# EAGLE board Sequencer-Memory-V1.0-3 (EAGLE 7.6.0)
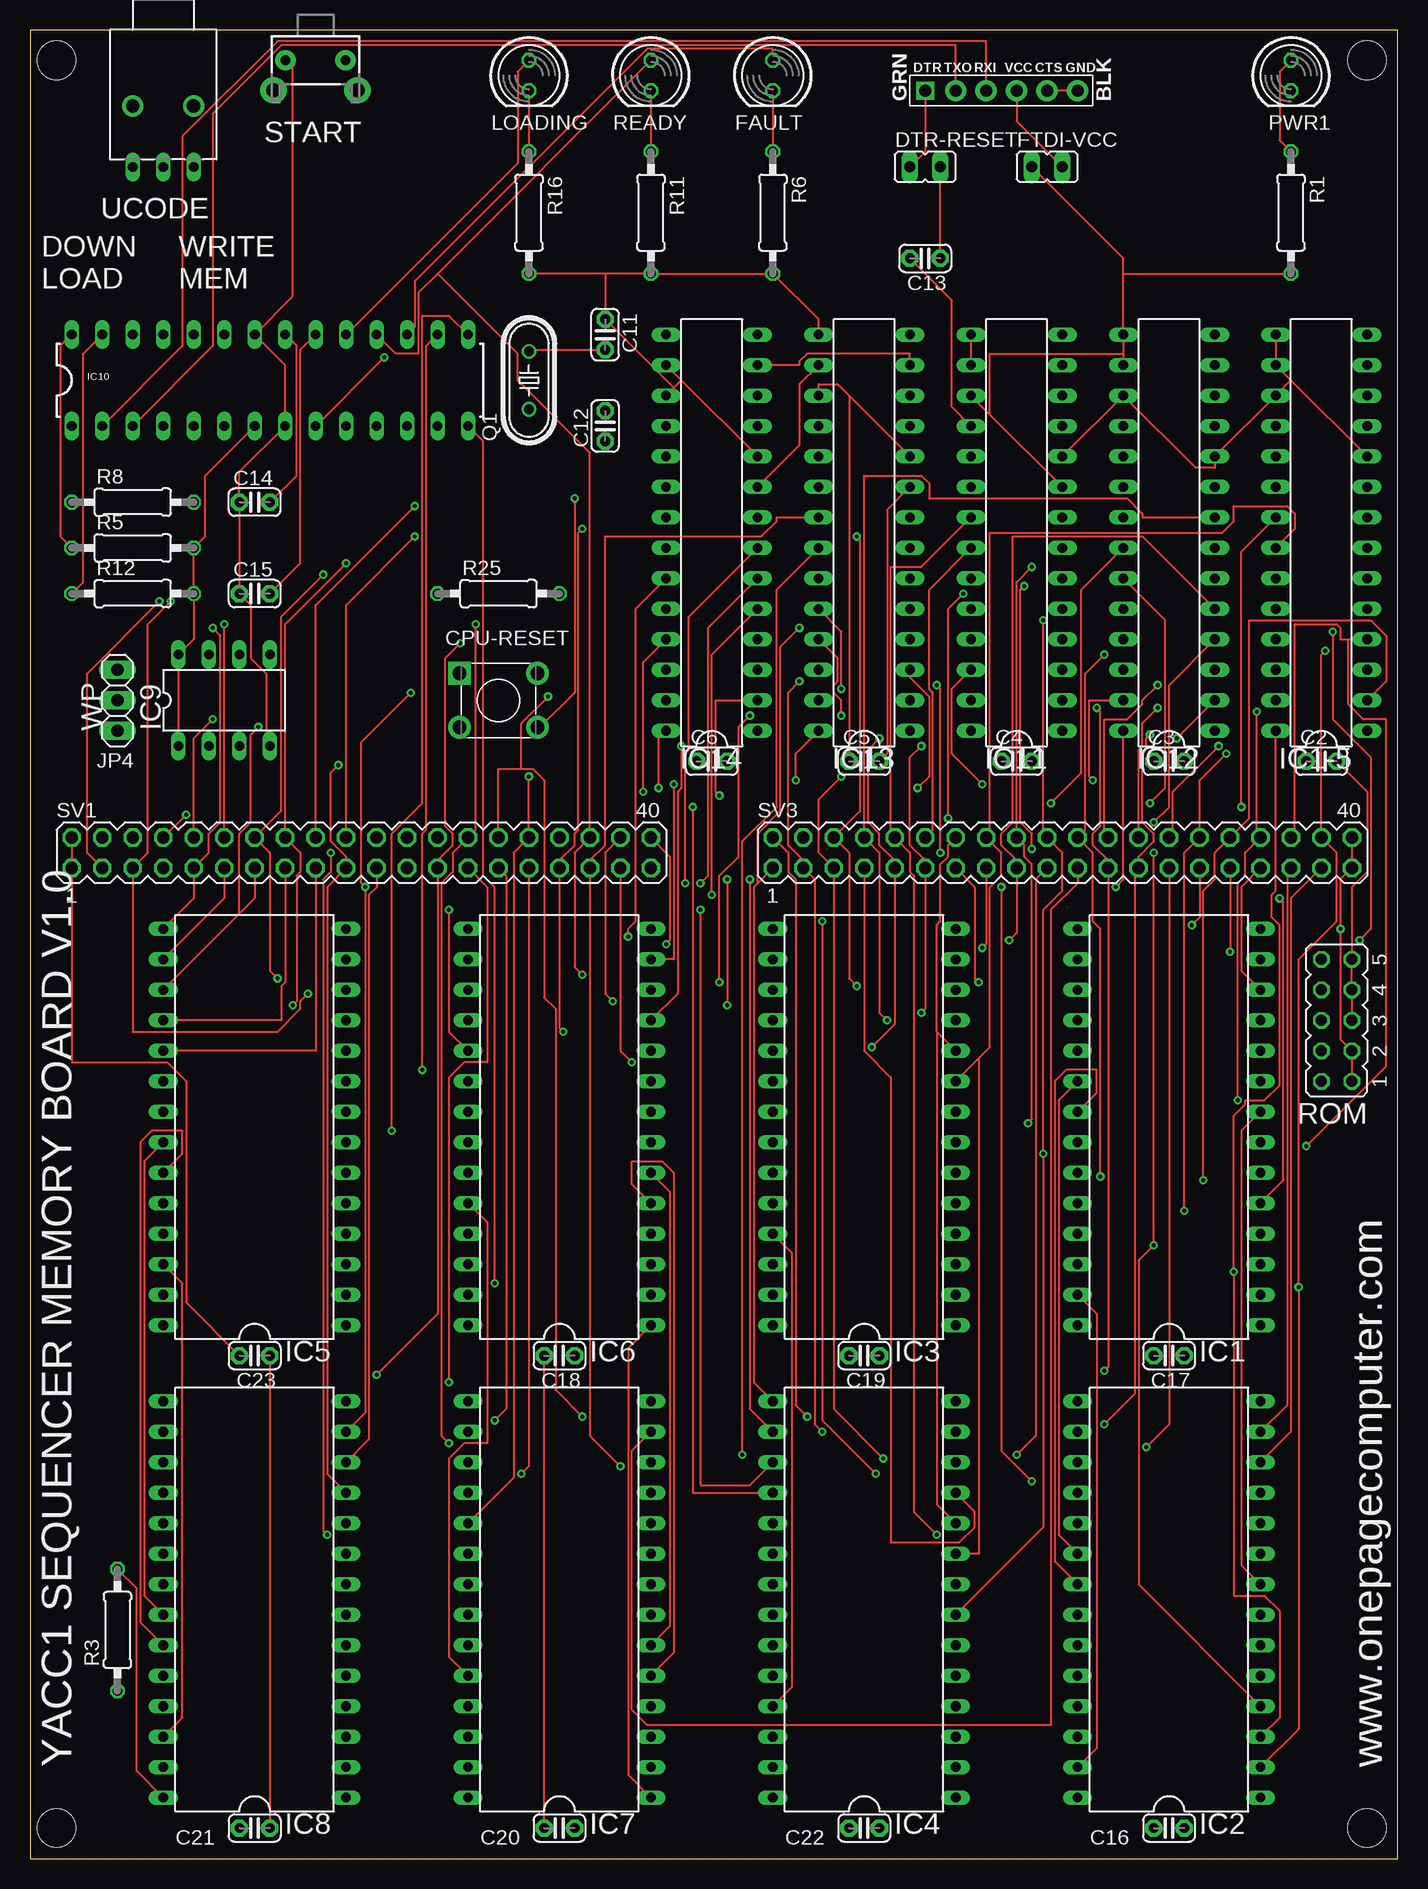
[diagram p4: board, top side]
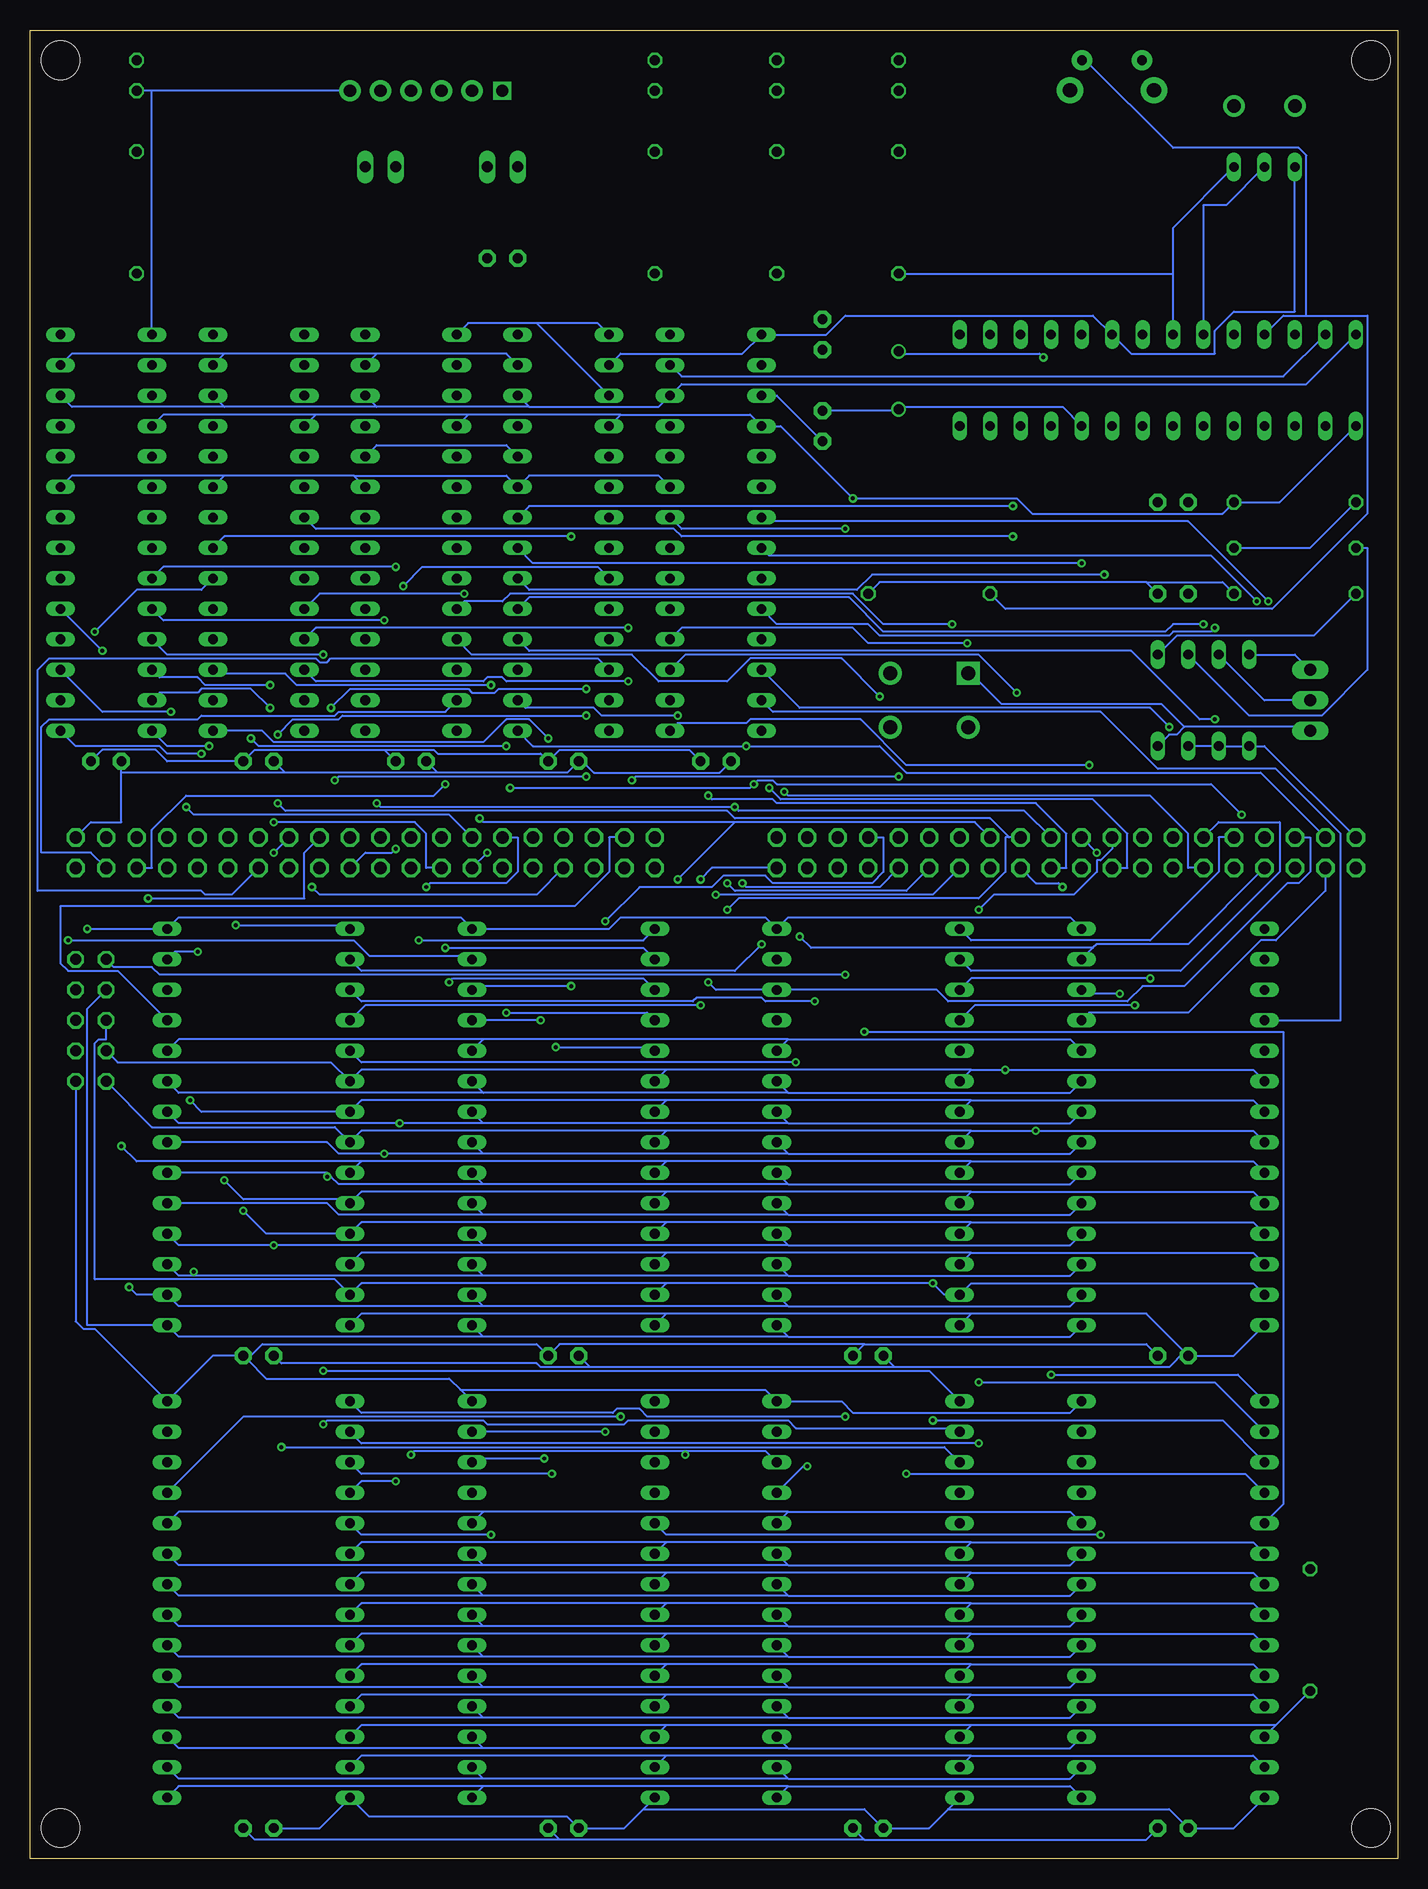
[diagram p5: board, bottom side, seen from below]

Size 113.97 x 152.38 mm. Coordinates in mm from the lower left corner, seen from the top.
Outline: 113.97,0 113.97,152.38 0,152.38 0,0 113.97,0
Copper layers (1*16): Top 0.0356mm / dielectric 1.5011mm / Bottom 0.0356mm
Design rules "LaenPCBOrder *": minimum track width 6mil, minimum drill 13mil, track to track 6mil, track to pad 6mil, pad to pad 6mil, via to via 6mil, smd to smd 6mil, copper to edge 15mil, drill to drill 6mil, minimum pad ring 7mil, minimum via ring 7mil, stop-mask expansion 3mil, vias tented up to drill 0mil, thermal gap 10mil
Holes 3.2 mm at 111.43,2.54 111.43,149.86 2.21,149.86 2.21,2.54

## Footprints (pad centres in the part's own frame; a part is rotated, then mirrored left to right if it is on the bottom)
C025-024X044 = drill 0.813 pad 1.422 octagon: 1 -1.27,0; 2 1.27,0
SW4-6.2X6.2X5.0MM = drill 1.143 pad 1.905 square: 1 -3.25,2.25 | drill 1.143 pad 1.905: 2 -3.25,-2.25; 3 3.25,-2.25; 4 3.25,2.25
JP1 = drill 0.914 long: 1 0,-1.27; 2 0,1.27
LED5MM = drill 0.813 octagon: A -1.27,0; K 1.27,0
DIL28-6 = drill 0.813 long: 1 -16.51,-7.62; 2 -13.97,-7.62; 3 -11.43,-7.62; 4 -8.89,-7.62; 5 -6.35,-7.62; 6 -3.81,-7.62; 7 -1.27,-7.62; 8 1.27,-7.62; 9 3.81,-7.62; 10 6.35,-7.62; 11 8.89,-7.62; 12 11.43,-7.62; 13 13.97,-7.62; 14 16.51,-7.62; 15 16.51,7.62; 16 13.97,7.62; 17 11.43,7.62; 18 8.89,7.62; 19 6.35,7.62; 20 3.81,7.62; 21 1.27,7.62; 22 -1.27,7.62; 23 -3.81,7.62; 24 -6.35,7.62; 25 -8.89,7.62; 26 -11.43,7.62; 27 -13.97,7.62; 28 -16.51,7.62
DIL28-3 = drill 0.813 long: 1 -16.51,-3.81; 2 -13.97,-3.81; 3 -11.43,-3.81; 4 -8.89,-3.81; 5 -6.35,-3.81; 6 -3.81,-3.81; 7 -1.27,-3.81; 8 1.27,-3.81; 9 3.81,-3.81; 10 6.35,-3.81; 11 8.89,-3.81; 12 11.43,-3.81; 13 13.97,-3.81; 14 16.51,-3.81; 15 16.51,3.81; 16 13.97,3.81; 17 11.43,3.81; 18 8.89,3.81; 19 6.35,3.81; 20 3.81,3.81; 21 1.27,3.81; 22 -1.27,3.81; 23 -3.81,3.81; 24 -6.35,3.81; 25 -8.89,3.81; 26 -11.43,3.81; 27 -13.97,3.81; 28 -16.51,3.81
DIL8 = drill 0.813 long: 1 -3.81,-3.81; 2 -1.27,-3.81; 3 1.27,-3.81; 4 3.81,-3.81; 5 3.81,3.81; 6 1.27,3.81; 7 -1.27,3.81; 8 -3.81,3.81
FTDI_DEVICE_SIDE = drill 1 square: P$1 -6.35,0 | drill 1.016 pad 1.778: P$2 -3.81,0; P$3 -1.27,0; P$4 1.27,0; P$5 3.81,0; P$6 6.35,0
1X03 = drill 1.016 long: 1 -2.54,0; 2 0,0; 3 2.54,0
HC49/S = drill 0.813: 1 -2.413,0; 2 2.413,0
0207/10 = drill 0.813 octagon: 1 -5.08,0; 2 5.08,0
JP5Q = drill 0.914 octagon: 1 -5.08,-1.27; 2 -5.08,1.27; 3 -2.54,-1.27; 4 -2.54,1.27; 5 0,-1.27; 6 0,1.27; 7 2.54,-1.27; 8 2.54,1.27; 9 5.08,-1.27; 10 5.08,1.27
TACTILE-PTH-SIDEEZ = drill 0.8 pad 1.7: 1 -2.5,0; 2 2.5,0 | drill 1.2 pad 2.2: ANCHOR1 -3.5,2.5; ANCHOR2 3.5,2.5
MA20-2 = drill 1.016 octagon: 1 -24.13,-1.27; 2 -24.13,1.27; 3 -21.59,-1.27; 4 -21.59,1.27; 5 -19.05,-1.27; 6 -19.05,1.27; 7 -16.51,-1.27; 8 -16.51,1.27; 9 -13.97,-1.27; 10 -13.97,1.27; 11 -11.43,-1.27; 12 -11.43,1.27; 13 -8.89,-1.27; 14 -8.89,1.27; 15 -6.35,-1.27; 16 -6.35,1.27; 17 -3.81,-1.27; 18 -3.81,1.27; 19 -1.27,-1.27; 20 -1.27,1.27; 21 1.27,-1.27; 22 1.27,1.27; 23 3.81,-1.27; 24 3.81,1.27; 25 6.35,-1.27; 26 6.35,1.27; 27 8.89,-1.27; 28 8.89,1.27; 29 11.43,-1.27; 30 11.43,1.27; 31 13.97,-1.27; 32 13.97,1.27; 33 16.51,-1.27; 34 16.51,1.27; 35 19.05,-1.27; 36 19.05,1.27; 37 21.59,-1.27; 38 21.59,1.27; 39 24.13,-1.27; 40 24.13,1.27
9070-1W = drill 0.813 long: 1 5.08,-2.54; 2 5.08,0; 3 5.08,2.54 | drill 1.118 pad 1.778: B 0,-2.54; B1 0,2.54

## Placement (x,y rotation side)
C2  0.1  [C025-024X044]  107.62,91.44 0 top
C3  0.1  [C025-024X044]  94.92,91.44 0 top
C4  0.1  [C025-024X044]  82.22,91.44 0 top
C5  0.1  [C025-024X044]  69.52,91.44 0 top
C6  0.1  [C025-024X044]  56.82,91.44 0 top
C11  20pf  [C025-024X044]  47.93,127 270 top
C12  20pf  [C025-024X044]  47.93,119.38 90 top
C13  0.1  [C025-024X044]  74.6,133.35 180 top
C14  0.1  [C025-024X044]  18.72,113.03 0 top
C15  0.1  [C025-024X044]  18.72,105.41 0 top
C16  0.1  [C025-024X044]  94.92,2.54 180 top
C17  0.1  [C025-024X044]  94.92,41.91 180 top
C18  0.1  [C025-024X044]  44.12,41.91 180 top
C19  0.1  [C025-024X044]  69.52,41.91 180 top
C20  0.1  [C025-024X044]  44.12,2.54 180 top
C21  0.1  [C025-024X044]  18.72,2.54 180 top
C22  0.1  [C025-024X044]  69.52,2.54 180 top
C23  0.1  [C025-024X044]  18.72,41.91 180 top
CPU-RESET  TS-1109-7  [SW4-6.2X6.2X5.0MM]  39.04,96.52 0 top
DTR-RESET  [JP1]  74.6,140.97 270 top
FAULT  [LED5MM]  61.9,148.59 270 top
FTDI-VCC  [JP1]  84.76,140.97 270 top
IC1  [DIL28-6]  94.92,60.96 90 top
IC1-5  MCP23017SP  [DIL28-3]  107.62,110.49 90 top
IC2  [DIL28-6]  94.92,21.59 90 top
IC3  [DIL28-6]  69.52,60.96 90 top
IC4  [DIL28-6]  69.52,21.59 90 top
IC5  [DIL28-6]  18.72,60.96 90 top
IC6  [DIL28-6]  44.12,60.96 90 top
IC7  [DIL28-6]  44.12,21.59 90 top
IC8  [DIL28-6]  18.72,21.59 90 top
IC9  24AA01P  [DIL8]  16.18,96.52 0 top
IC10  ATMEGA328P_PDIP  [DIL28-3]  19.99,123.19 0 top
IC11  MCP23017SP  [DIL28-3]  82.22,110.49 90 top
IC12  MCP23017SP  [DIL28-3]  94.92,110.49 90 top
IC13  MCP23017SP  [DIL28-3]  69.52,110.49 90 top
IC14  MCP23017SP  [DIL28-3]  56.82,110.49 90 top
JP3  FTDI_DEVICE  [FTDI_DEVICE_SIDE]  80.95,147.32 0 top
JP4  [1X03]  7.29,96.52 90 top
LOADING  [LED5MM]  41.58,148.59 270 top
PWR1  [LED5MM]  105.08,148.59 270 top
Q1  16Mhz  [HC49/S]  41.58,123.19 90 top
R1  330  [0207/10]  105.08,137.16 270 top
R3  10k  [0207/10]  7.29,19.05 90 top
R5  2.2k  [0207/10]  8.56,109.22 0 top
R6  330  [0207/10]  61.9,137.16 270 top
R8  10k  [0207/10]  8.56,113.03 0 top
R11  330  [0207/10]  51.74,137.16 270 top
R12  2.2k  [0207/10]  8.56,105.41 0 top
R16  330  [0207/10]  41.58,137.16 270 top
R25  10k  [0207/10]  39.04,105.41 0 top
READY  [LED5MM]  51.74,148.59 270 top
ROM  [JP5Q]  108.89,69.85 90 top
START  SWITCH-MOMENTARY-2SIDE_EZ  [TACTILE-PTH-SIDEEZ]  23.8,149.86 180 top
SV1  [MA20-2]  27.61,83.82 0 top
SV3  [MA20-2]  86.03,83.82 0 top
UCODE  [9070-1W]  11.1,146.05 270 top

## Tracks (layer width: path | path; a pad name or v marks a point on that pad's centre or on a via)
1-BYTE-OPERAND-SEL  (via drill 0.33)
  Top 0.152: SV3.31 v100,75.56
  Bottom 0.152: IC1.13 101.91,75.56 v100,75.56
2-BYTE-OPERAND-SEL  (via drill 0.33)
  Top 0.152: v96.83,77.79 97.46,78.42 SV3.29
  Bottom 0.152: IC1.15 87.62,77.79 v96.83,77.79
-CMEMRD  (via drill 0.33)
  Top 0.152: IC10.15 34.91,128.59 32.69,128.59 32.69,87.95 30.15,85.41 v30.15,60.64 | IC8.22 9.51,21.91 9.51,58.1 IC5.22
  Bottom 0.152: IC8.22 12.05,21.27 35.55,21.27 | IC7.22 35.55,21.27 | 60.95,21.27 IC4.22 | 35.55,21.27 60.95,21.27 | IC2.22 86.35,21.27 60.95,21.27 | ROM.2 103.81,60.96 88.57,60.96 IC1.22 86.35,60.64 60.95,60.64 | IC5.22 12.05,60.64 v30.15,60.64 35.55,60.64 | IC6.22 35.55,60.64 | 60.95,60.64 IC3.22 | 35.55,60.64 60.95,60.64
-CMEMSEL  (via drill 0.33)
  Top 0.152: IC10.16 33.01,126.05 33.01,85.72 32.69,85.41 v32.69,65.72 | IC2.20 85.71,26.99 85.71,63.18 IC1.20
  Bottom 0.152: IC8.20 12.05,26.35 35.55,26.35 | IC7.20 35.55,26.35 | 60.95,26.35 IC4.20 | 35.55,26.35 60.95,26.35 | IC2.20 86.35,26.35 60.95,26.35 | ROM.4 106.67,66.36 88.89,66.36 IC1.20 86.35,65.72 60.95,65.72 | IC5.20 12.05,65.72 v32.69,65.72 35.55,65.72 | IC6.20 35.55,65.72 | 60.95,65.72 IC3.20 | 35.55,65.72 60.95,65.72
-CMEMWR  (via drill 0.33)
  Top 0.152: IC10.14 37.77,118.11 37.77,81.92 38.72,80.96 v38.72,47.94 | IC2.27 88.89,9.21 88.89,45.4 IC1.27
  Bottom 0.152: IC8.27 12.05,8.57 35.55,8.57 | IC7.27 35.55,8.57 | 60.95,8.57 IC4.27 | 35.55,8.57 60.95,8.57 | IC2.27 86.35,8.57 60.95,8.57 | IC5.27 12.05,47.94 35.55,47.94 IC6.27 37.77,46.99 v38.72,47.94 60.95,47.94 | 60.95,47.94 IC3.27 | 60.95,47.94 86.35,47.94 IC1.27 88.57,48.26 108.57,48.26 108.57,67.94 108.25,68.26 107.62,68.26 ROM.6
-RESET  (via drill 0.33)
  Top 0.152: C13.2 76.82,129.86 76.82,120.97 IC11.18 | v45.39,113.35 45.39,97.16 42.53,94.3 CPU-RESET.3
  Bottom 0.152: IC10.1 9.83,113.03 R8.2 14.59,112.08 30.47,112.08 31.74,113.35 v45.39,113.35 51.42,119.38 IC14.18 53.96,120.33 64.76,120.33 | IC13.18 64.76,120.33 | 77.46,120.33 IC11.18 | 64.76,120.33 77.46,120.33 | 90.16,120.33 IC12.18 | 77.46,120.33 90.16,120.33 | IC1-5.18 102.86,120.33 90.16,120.33
AC-LD  (via drill 0.33)
  Top 0.152: v79.05,73.03 78.73,73.34 78.73,80.96 SV3.13 | v75.55,97.79 75.87,97.47 v75.87,83.82
  Bottom 0.152: IC3.17 62.85,73.34 78.73,73.34 v79.05,73.03 | IC12.3 98.41,98.74 92.7,98.74 91.75,97.79 v75.55,97.79 | SV3.13 v75.87,83.82
AC-LD-INV  (via drill 0.33)
  Top 0.152: v74.28,70.48 74.6,70.8 SV3.11 74.6,83.19 73.33,84.45 73.33,91.76 v74.28,92.71 | v95.56,93.34 IC12.2
  Bottom 0.152: IC3.18 62.54,70.48 v74.28,70.48 | v95.56,93.34 94.92,92.71 v74.28,92.71
AC-RD  (via drill 0.33)
  Top 0.152: v79.36,75.88 79.68,76.2 SV3.15 | IC12.4 94.92,97.79 94.92,87.63 v93.65,86.36
  Bottom 0.152: IC3.16 62.85,75.88 v79.36,75.88 | v93.65,86.36 81.9,86.36 80.95,85.41 80.95,82.55 SV3.15
ADDR-REG-ID0  (via drill 0.33)
  Top 0.152: v23.17,72.07 22.53,71.44 22.53,70.8 20.62,68.9 8.56,68.9 SV1.5 9.83,83.82 9.83,102.87 v11.73,104.78
  Bottom 0.152: IC5.12 26.02,72.07 v23.17,72.07 | IC14.22 52.38,108.58 15.54,108.58 v11.73,104.78
ADDR-REG-ID1  (via drill 0.33)
  Top 0.152: IC14.23 50.47,104.14 50.47,78.11 49.84,77.47 v49.84,76.83
  Bottom 0.152: 25.39,75.88 25.07,76.2 17.45,76.2 SV1.7 | 25.39,75.88 IC5.13 | v49.84,76.83 48.88,75.88 25.39,75.88
ADDR-REG-LD  (via drill 0.33)
  Top 0.152: IC5.15 13.64,80.01 SV1.9 14.91,83.82 14.91,85.41 15.86,86.36 15.86,101.92 v15.23,102.55
  Bottom 0.152: IC14.24 51.74,102.87 44.12,102.87 43.17,101.92 19.04,101.92 18.72,102.23 15.54,102.23 v15.23,102.55
ADDR-REG-RD  (via drill 0.33)
  Top 0.152: IC5.16 16.18,80.01 SV1.11 | IC14.25 51.11,99.69 v51.11,88.9
  Bottom 0.152: v51.11,88.9 50.79,88.58 20.62,88.58 17.45,85.41 17.45,82.55 SV1.11
ALU0  (via drill 0.33)
  Top 0.152: v66.03,35.56 65.39,36.2 65.39,81.6 SV3.3 64.44,83.19 63.17,84.45 63.17,97.16 v64.12,98.11
  Bottom 0.152: v66.03,35.56 IC4.13 | IC12.26 90.16,98.11 76.19,98.11 75.87,98.42 74.6,98.42 74.28,98.11 v64.12,98.11
ALU1  (via drill 0.33)
  Top 0.152: v71.11,33.34 66.98,37.47 SV3.5 65.71,83.82 65.71,88.27 v67.61,90.17 | IC12.27 88.25,96.52 88.25,90.17 v88.57,89.85
  Bottom 0.152: IC4.12 76.82,33.34 v71.11,33.34 | v88.57,89.85 88.25,90.17 v67.61,90.17
ALU2  (via drill 0.33)
  Top 0.152: IC4.11 78.73,28.89 78.73,27.62 77.46,26.35 71.74,26.35 71.74,65.09 69.52,67.31 SV3.7 | IC12.28 91.11,81.6 v90.48,80.96
  Bottom 0.152: v90.48,80.96 89.84,80.33 71.74,80.33 SV3.7
ALU3  (via drill 0.33)
  Top 0.152: v70.16,67.63 72.06,69.53 SV3.9 72.06,83.19 70.79,84.45 70.79,85.41 69.84,86.36 69.84,92.39 v70.79,93.34
  Bottom 0.152: IC3.19 62.22,67.63 v70.16,67.63 | IC12.1 94.6,93.98 93.65,93.03 76.19,93.03 74.28,94.93 72.38,94.93 v70.79,93.34
ALU-FUNC  (via drill 0.33)
  Top 0.152: IC4.15 60.31,39.69 60.31,80.96 60.63,81.28 | SV3.1 60.63,81.28 | v64.12,102.55 62.54,100.97 62.54,87.31 60.63,85.41 60.63,81.28
  Bottom 0.152: IC12.25 90.16,102.55 v64.12,102.55
ARD-RXIN
  Top 0.152: IC10.2 12.69,126.05 12.69,143.51 20.62,151.45 79.68,151.45 JP3.P$3
ARD-TXOUT
  Top 0.152: IC10.3 15.23,126.05 15.23,145.41 20.94,151.13 77.14,151.13 JP3.P$2
BR-COND  (via drill 0.33)
  Top 0.152: v110.8,76.52 111.75,77.47 111.75,91.76 108.57,94.93 v108.57,102.23
  Bottom 0.152: IC3.13 77.46,75.25 85.71,75.25 86.98,76.52 v110.8,76.52 | v108.57,102.23 105.08,105.73 99.68,105.73 IC12.6
BRANCH-LD-HI  (via drill 0.33)
  Top 0.152: v53.01,76.2 53.33,76.52 53.33,83.5 SV1.40
  Bottom 0.152: IC1.16 86.35,73.98 55.23,73.98 v53.01,76.2
BRANCH-LD-LO  (via drill 0.33)
  Top 0.152: v58.09,81.6 v58.09,71.12
  Bottom 0.152: IC1.18 86.03,71.12 v58.09,71.12 | v58.09,81.6 57.14,82.55 SV1.39
BRANCH-RD-HI  (via drill 0.33)
  Top 0.152: v48.57,71.44 47.93,72.07 47.93,83.82 SV1.38
  Bottom 0.152: IC1.17 86.35,71.44 58.73,71.44 58.41,71.75 53.01,71.75 52.69,71.44 v48.57,71.44
BRANCH-RD-LO  (via drill 0.33)
  Top 0.152: v50.15,66.36 49.2,67.31 SV1.37
  Bottom 0.152: IC1.19 86.35,66.36 v50.15,66.36
CADDR0  (via drill 0.33)
  Top 0.152: IC1-5.21 100.95,108.9 v100.95,87.63 | SV3.14 76.5,84.45 76.5,83.5 75.87,82.87 75.87,78.11 75.55,77.79 75.55,68.9 | IC3.10 75.55,68.9 | IC4.10 75.55,29.53 75.55,68.9
  Bottom 0.152: IC8.10 27.29,28.89 50.79,28.89 | IC7.10 50.79,28.89 | 76.19,28.89 IC4.10 | 50.79,28.89 76.19,28.89 | IC2.10 101.59,28.89 76.19,28.89 | v100.95,87.63 100.32,87 79.05,87 SV3.14 | IC5.10 27.29,68.26 50.79,68.26 | IC6.10 50.79,68.26 | 76.19,68.26 IC3.10 | 50.79,68.26 76.19,68.26 | IC1.10 101.59,68.26 76.19,68.26
CADDR1
  Top 0.152: IC1-5.22 105.4,110.81 105.4,112.08 104.76,112.71 100.32,112.71 100.32,111.44 99.36,110.49 80,110.49 80,85.41 SV3.16 80.95,83.82 80.95,81.92 80,80.96 80,67.63 79.05,66.67 | IC3.9 79.05,66.67 | IC4.9 79.05,25.4 79.05,66.67
  Bottom 0.152: IC8.9 27.29,24.45 50.79,24.45 | IC7.9 50.79,24.45 | 76.19,24.45 IC4.9 | 50.79,24.45 76.19,24.45 | IC2.9 101.59,24.45 76.19,24.45 | IC5.9 27.29,63.82 50.79,63.82 | IC6.9 50.79,63.82 | 76.19,63.82 IC3.9 | 50.79,63.82 76.19,63.82 | IC1.9 101.59,63.82 76.19,63.82
CADDR2  (via drill 0.33)
  Top 0.152: v83.49,107.63 82.22,106.36 SV3.18 82.86,84.45 82.86,83.5 83.49,82.87 83.49,61.59 v83.17,61.28 | IC2.8 100.95,24.45 100.95,60.64 IC1.8
  Bottom 0.152: IC8.8 27.29,21.91 50.79,21.91 | IC7.8 50.79,21.91 | 76.19,21.91 IC4.8 | 50.79,21.91 76.19,21.91 | IC2.8 101.59,21.91 76.19,21.91 | IC1-5.23 102.86,107.63 v83.49,107.63 | IC5.8 27.29,61.28 50.79,61.28 | IC6.8 50.79,61.28 | 76.19,61.28 IC3.8 | 50.79,61.28 76.19,61.28 | IC1.8 101.59,61.28 v83.17,61.28 76.19,61.28
CADDR3  (via drill 0.33)
  Top 0.152: v84.44,103.19 84.44,85.41 SV3.20 86.03,83.82 86.03,80.64 84.44,79.06 v84.44,58.74 84.44,27.62 IC4.7
  Bottom 0.152: IC8.7 27.29,19.37 50.79,19.37 | IC7.7 50.79,19.37 | 76.19,19.37 IC4.7 | 50.79,19.37 76.19,19.37 | IC2.7 101.59,19.37 76.19,19.37 | IC1-5.24 102.86,103.19 v84.44,103.19 | IC5.7 27.29,58.74 50.79,58.74 | IC6.7 50.79,58.74 | 76.19,58.74 IC3.7 | 50.79,58.74 76.19,58.74 | IC1.7 89.2,59.69 88.25,58.74 v84.44,58.74 76.19,58.74
CADDR4  (via drill 0.33)
  Top 0.152: v89.52,100.33 87.94,98.74 87.94,85.72 SV3.22 88.57,83.82 88.57,78.11 89.2,77.47 v89.2,56.83 | IC7.6 53.33,19.37 53.33,55.56 IC6.6
  Bottom 0.152: IC8.6 27.29,16.83 50.79,16.83 | IC7.6 50.79,16.83 | 76.19,16.83 IC4.6 | 50.79,16.83 76.19,16.83 | IC2.6 101.59,16.83 76.19,16.83 | IC1-5.25 102.54,100.33 v89.52,100.33 | IC5.6 27.29,56.2 50.79,56.2 | IC6.6 50.79,56.2 | 76.19,56.2 IC3.6 | 50.79,56.2 76.19,56.2 | IC1.6 89.2,57.15 88.89,56.83 | 88.89,56.83 88.25,56.2 76.19,56.2 | 88.89,56.83 v89.2,56.83
CADDR5  (via drill 0.33)
  Top 0.152: v93.97,97.79 92.7,96.52 92.7,96.2 91.43,94.93 89.52,94.93 89.52,85.41 SV3.24 | v104.13,80.01 104.45,79.69 104.45,56.52 IC1.5 | IC7.5 53.65,17.14 53.65,57.15 52.69,58.1 50.15,58.1 50.15,56.2 IC6.5
  Bottom 0.152: IC8.5 27.29,14.29 50.79,14.29 | IC7.5 50.79,14.29 | 76.19,14.29 IC4.5 | 50.79,14.29 76.19,14.29 | IC2.5 101.59,14.29 76.19,14.29 | IC1-5.26 103.17,98.42 100,98.42 99.36,97.79 v93.97,97.79 | IC5.5 27.29,53.66 50.79,53.66 | IC6.5 50.79,53.66 | 76.19,53.66 IC3.5 | 50.79,53.66 76.19,53.66 | IC1.5 89.2,54.61 88.25,53.66 76.19,53.66 | SV3.24 91.11,83.82 91.11,80.01 v104.13,80.01
CADDR6  (via drill 0.33)
  Top 0.152: v93.97,95.89 92.7,94.61 92.7,92.71 92.38,92.39 SV3.26 | v93.65,83.82 v93.65,51.12 92.38,49.85 92.38,22.86 IC2.4
  Bottom 0.152: IC8.4 27.29,11.75 50.79,11.75 | IC7.4 50.79,11.75 | 76.19,11.75 IC4.4 | 50.79,11.75 76.19,11.75 | IC2.4 101.59,11.75 76.19,11.75 | IC1-5.27 103.17,97.16 100,97.16 99.68,97.47 95.56,97.47 v93.97,95.89 | IC5.4 27.29,51.12 50.79,51.12 | IC6.4 50.79,51.12 | 76.19,51.12 IC3.4 | 50.79,51.12 76.19,51.12 | IC1.4 101.59,51.12 v93.65,51.12 76.19,51.12 | v93.65,83.82 SV3.26
CADDR7  (via drill 0.33)
  Top 0.152: v99.05,92.71 95.24,88.9 95.24,85.41 SV3.28 | IC1-5.28 103.81,80.64 103.49,80.33 103.49,78.42 104.13,77.79 104.13,64.45 102.86,63.18 101.27,63.18 101.27,62.87 100.32,61.91 v100.32,48.9 100.32,21.91 102.86,21.91 104.13,20.64 104.13,11.75 IC2.3
  Bottom 0.152: IC8.3 27.29,9.21 50.79,9.21 | IC7.3 50.79,9.21 | 76.19,9.21 IC4.3 | 50.79,9.21 76.19,9.21 | IC2.3 101.59,9.21 76.19,9.21 | IC1-5.28 102.54,92.71 v99.05,92.71 | IC5.3 27.29,48.58 50.79,48.58 | IC6.3 50.79,48.58 | 76.19,48.58 IC3.3 | 50.79,48.58 76.19,48.58 | IC1.3 101.59,48.58 100.32,48.58 | 76.19,48.58 100.32,48.58 | 100.32,48.58 v100.32,48.9
CADDR8  (via drill 0.33)
  Top 0.152: v99.68,92.08 97.46,89.85 SV3.30 96.19,83.82 v96.19,53.98 | IC4.25 63.49,14.29 63.49,50.48 IC3.25
  Bottom 0.152: IC8.25 12.05,13.65 35.55,13.65 | IC7.25 35.55,13.65 | 60.95,13.65 IC4.25 | 35.55,13.65 60.95,13.65 | IC2.25 86.35,13.65 60.95,13.65 | IC1-5.1 110.16,92.71 103.17,92.71 102.54,92.08 v99.68,92.08 | IC5.25 12.05,53.02 35.55,53.02 | IC6.25 35.55,53.02 | 60.95,53.02 IC3.25 | 35.55,53.02 60.95,53.02 | 60.95,53.02 86.35,53.02 IC1.25 94.28,52.07 v96.19,53.98
CADDR9  (via drill 0.33)
  Top 0.152: IC1-5.2 113.02,98.11 113.02,101.92 111.75,103.19 101.59,103.19 101.59,86.68 SV3.32 98.73,83.82 98.73,81.6 97.78,80.64 v97.78,56.52 | IC7.24 34.91,16.83 34.91,33.34 36.18,34.61 38.09,34.61 38.09,53.02 IC6.24
  Bottom 0.152: IC8.24 12.05,16.19 35.55,16.19 | IC7.24 35.55,16.19 | 60.95,16.19 IC4.24 | 35.55,16.19 60.95,16.19 | IC2.24 86.35,16.19 60.95,16.19 | IC5.24 12.05,55.56 35.55,55.56 | IC6.24 35.55,55.56 | 60.95,55.56 IC3.24 | 35.55,55.56 60.95,55.56 | 86.98,54.93 86.35,55.56 60.95,55.56 | v97.78,56.52 96.19,54.93 86.98,54.93 | 86.98,54.93 IC1.24
CADDR10  (via drill 0.33)
  Top 0.152: v102.22,95.57 102.22,85.41 SV3.34 101.27,83.82 101.27,81.92 100.64,81.28 v100.64,63.18 | IC2.21 85.39,24.77 85.39,64.77 86.35,65.72 88.89,65.72 88.89,63.82 IC1.21
  Bottom 0.152: IC8.21 12.05,23.81 35.55,23.81 | IC7.21 35.55,23.81 | 60.95,23.81 IC4.21 | 35.55,23.81 60.95,23.81 | IC2.21 86.35,23.81 60.95,23.81 | IC1-5.3 107.94,95.57 v102.22,95.57 | IC5.21 12.05,63.18 35.55,63.18 | IC6.21 35.55,63.18 | 60.95,63.18 IC3.21 | 35.55,63.18 60.95,63.18 | 60.95,63.18 86.35,63.18 IC1.21 99.68,62.23 v100.64,63.18
CADDR11  (via drill 0.33)
  Top 0.152: 109.84,101.6 109.21,101.6 109.21,102.55 108.89,102.87 105.4,102.87 105.4,85.41 SV3.36 | 109.84,101.6 IC1-5.4 | 109.84,101.6 109.84,96.2 111.11,94.93 113.02,94.93 113.02,66.04 v106.35,59.37 | IC8.23 9.2,19.68 9.2,59.69 10.15,60.64 12.69,60.64 12.69,58.74 IC5.23
  Bottom 0.152: IC8.23 12.05,18.73 35.55,18.73 | IC7.23 35.55,18.73 | 60.95,18.73 IC4.23 | 35.55,18.73 60.95,18.73 | IC2.23 86.35,18.73 60.95,18.73 | IC5.23 12.05,58.1 35.55,58.1 | IC6.23 35.55,58.1 | 60.95,58.1 IC3.23 | 35.55,58.1 60.95,58.1 | 86.35,58.1 IC1.23 | 60.95,58.1 86.35,58.1 | v106.35,59.37 105.08,58.1 86.35,58.1
CADDR12  (via drill 0.33)
  Top 0.152: v107.94,100.65 107.62,100.33 SV3.38 108.89,83.82 108.89,78.11 105.72,74.93 v105.72,47.62 105.72,10.79 IC2.2
  Bottom 0.152: IC8.2 27.29,6.67 50.79,6.67 | IC7.2 50.79,6.67 | 76.19,6.67 IC4.2 | 50.79,6.67 76.19,6.67 | IC2.2 101.59,6.67 76.19,6.67 | v107.94,100.65 IC1-5.5 | IC5.2 27.29,46.04 50.79,46.04 | IC6.2 50.79,46.04 | 76.19,46.04 IC3.2 | 50.79,46.04 76.19,46.04 | 76.19,46.04 101.59,46.04 IC1.2 105.08,46.99 v105.72,47.62
CMEMSEL
  Top 0.152: IC5.26 12.69,47.94 12.69,11.75 IC8.26
  Bottom 0.152: IC5.26 12.05,50.48 35.55,50.48 | IC6.26 35.55,50.48 | 60.95,50.48 IC3.26 | 35.55,50.48 60.95,50.48 | IC1.26 86.35,50.48 60.95,50.48 | R3.1 10.15,11.11 | 10.15,11.11 IC8.26 | 35.55,11.11 IC7.26 | 10.15,11.11 35.55,11.11 | 60.95,11.11 IC4.26 | 35.55,11.11 60.95,11.11 | IC2.26 86.35,11.11 60.95,11.11
FAULT
  Top 0.152: IC10.17 32.05,127.64 32.05,131.44 51.42,150.81 61.9,150.81 FAULT.A
GND  (via drill 0.33)
  Top 0.152: C23.1 C21.1 | ROM.1 ROM.3 109.21,68.26 v109.21,77.47 109.21,81.6 SV3.39 SV3.40 | START.2 21.58,149.86 21.9,149.54 21.9,130.18 IC10.22 21.26,124.46 IC10.8 17.45,115.57 C14.1 C15.1 18.4,104.46 18.4,100.01 19.67,98.74 19.67,93.03 IC9.4 | 68.25,121.92 67.3,122.87 65.71,122.87 IC13.17 | 68.25,121.92 IC13.10 | IC11.15 IC11.16 | IC13.15 65.71,128.27 R6.2 R11.2 47.93,132.08 | 47.93,132.08 R16.2 | 47.93,132.08 C11.1 53.65,122.56 | IC14.16 54.28,123.19 | 54.28,123.19 IC14.10 | 54.28,123.19 53.65,122.56 | 53.65,122.56 IC14.17 | JP3.P$6 JP3.P$5 | IC1-5.15 IC1-5.16 105.08,123.19 | 105.08,123.19 IC1-5.10 | IC11.10 IC12.17 97.14,115.89 98.73,115.89 IC12.10 IC1-5.17 105.08,123.19 | 68.25,121.92 C5.1
  Bottom 0.152: C21.1 20.94,1.59 44.44,1.59 | C20.1 44.44,1.59 | 69.84,1.59 C22.1 | 44.44,1.59 69.84,1.59 | C16.1 95.24,1.59 69.84,1.59 | C23.1 20.94,42.86 44.44,42.86 | C18.1 44.44,42.86 | 44.44,42.86 69.84,42.86 C19.1 71.74,42.86 94.6,42.86 95.87,41.59 | IC8.14 27.29,37.15 45.39,37.15 46.34,38.1 IC7.14 52.69,39.05 78.09,39.05 | 78.09,39.05 79.05,40.01 94.28,40.01 95.87,41.59 | 78.09,39.05 IC4.14 | 95.87,41.59 C17.1 98.73,41.91 IC2.14 108.57,44.13 109.53,44.13 110.16,44.77 ROM.1 | IC5.14 27.29,78.42 50.79,78.42 IC6.14 52.69,78.42 64.76,78.42 65.71,77.47 IC3.14 78.09,78.42 101.59,78.42 IC1.14 v109.21,77.47 | 106.35,90.49 106.35,86.36 108.89,86.36 SV3.40 | 106.35,90.49 C2.1 | C6.1 56.5,90.49 66.98,90.49 67.93,91.44 C5.1 69.2,90.49 80,90.49 | 80,90.49 C4.1 | 92.7,90.49 C3.1 | 80,90.49 92.7,90.49 | 92.7,90.49 106.35,90.49 | IC9.4 19.04,93.66 18.4,93.66 17.77,94.3 | 17.77,94.3 7.61,94.3 JP4.1 | 17.77,94.3 19.67,96.2 33.01,96.2 35.55,98.74 CPU-RESET.1 | UCODE.3 18.72,135.89 18.72,132.08 | IC10.22 18.72,132.08 | IC11.15 77.46,127.95 71.74,127.95 | 71.74,127.95 66.66,127.95 IC13.15 | 71.74,127.95 IC13.17 | C12.1 51.74,121.92 IC14.17 | JP3.P$6 103.81,147.32 | 103.81,147.32 PWR1.K | IC1-5.15 103.81,147.32 | IC13.10 74.28,117.79 85.08,117.79 IC11.10 | R16.2 18.72,132.08
H/L-SWAP  (via drill 0.33)
  Top 0.152: v68.89,72.71 68.25,73.34 68.25,83.82 SV3.6 69.2,87.31 69.2,109.86 v68.89,110.17
  Bottom 0.152: IC3.12 76.82,72.71 v68.89,72.71 | IC12.7 97.78,110.17 v68.89,110.17
I/D-REG-DN  (via drill 0.33)
  Top 0.152: IC6.13 53.65,74.93 v53.65,89.53 | v73.97,89.22 74.92,90.17 74.92,96.84 73.33,98.42 IC13.3 | v13.01,87 SV1.8
  Bottom 0.152: v73.97,89.22 53.96,89.22 v53.65,89.53 53.33,89.85 52.06,89.85 51.74,89.53 15.54,89.53 v13.01,87
I/D-REG-LD  (via drill 0.33)
  Top 0.152: IC6.11 53.96,72.07 53.96,88.9 54.28,89.22 v54.28,92.71
  Bottom 0.152: IC13.1 72.06,92.71 v54.28,92.71 43.17,92.71 40.95,90.49 11.42,90.49 SV1.4
I/D-REG-RD  (via drill 0.33)
  Top 0.152: v60,95.25 59.04,94.3 59.04,83.5 57.45,81.92 v57.45,73.03
  Bottom 0.152: SV1.6 7.29,85.09 7.29,82.23 8.24,81.28 9.2,81.28 17.77,72.71 21.26,72.71 22.53,71.44 37.45,71.44 38.41,72.39 IC6.12 56.82,72.39 v57.45,73.03 | IC13.2 72.7,95.89 66.98,95.89 66.34,95.25 v60,95.25
I/D-REG-UP  (via drill 0.33)
  Top 0.152: v15.23,94.93 13.64,93.34 SV1.10
  Bottom 0.152: IC6.15 35.55,76.52 20.62,76.52 14.91,82.23 14.91,85.09 SV1.10 | IC13.4 72.38,100.65 22.21,100.65 16.5,94.93 v15.23,94.93
I/O-ADDR  (via drill 0.33)
  Top 0.152: v93.02,34.29 94.92,36.2 SV3.27
  Bottom 0.152: IC7.17 37.77,34.29 v93.02,34.29 | IC13.26 66.66,100.01 88.89,100.01 89.2,99.69 89.84,99.69 90.16,100.01 112.38,100.01 113.34,99.06 113.34,80.64 99.68,80.64 99.36,80.33 97.14,80.33 SV3.27
I/O-RD  (via drill 0.33)
  Top 0.152: v89.52,36.2 92.06,38.73 92.06,82.23 SV3.25 92.38,83.5 93.65,84.77 93.65,85.41 92.7,86.36 92.7,92.08 93.02,92.39 93.02,93.34 v93.33,93.66 | IC13.25 67.3,100.01 67.3,98.11 66.98,97.79 66.98,97.16 67.61,96.52 v67.61,95.25
  Bottom 0.152: IC7.16 36.82,35.88 50.15,35.88 50.79,36.51 64.12,36.51 64.44,36.2 75.87,36.2 76.19,36.51 89.2,36.51 v89.52,36.2 | v67.61,95.25 87.94,95.25 88.25,94.93 92.06,94.93 v93.33,93.66
I/O-WR  (via drill 0.33)
  Top 0.152: v89.52,40.64 89.84,40.96 SV3.23 89.84,83.19 88.57,84.45 88.57,85.41 89.2,86.04 89.2,95.57 v88.89,95.89 | IC13.24 67.61,102.23 v67.61,97.47
  Bottom 0.152: IC7.15 39.04,40.64 v89.52,40.64 | v67.61,97.47 74.92,97.47 75.23,97.16 77.14,97.16 77.46,97.47 87.3,97.47 v88.89,95.89
INT-EN  (via drill 0.33)
  Top 0.152: v46.02,36.83 43.8,39.05 43.8,70.8 42.85,71.75 42.85,89.85 41.9,90.81 40.95,90.81 | 40.95,90.81 39.04,90.81 SV1.30 | v43.17,96.84 40.95,94.61 40.95,90.81
  Bottom 0.152: IC2.15 86.35,37.15 65.39,37.15 65.08,37.47 63.17,37.47 62.54,36.83 v46.02,36.83 | IC11.25 77.14,100.33 63.81,100.33 61.58,98.11 55.87,98.11 53.96,100.01 46.34,100.01 v43.17,96.84
INT-JMP
  Bottom 0.152: IC1.11 106.67,73.98 110.8,73.98 111.43,74.61 111.43,79.38 68.57,79.38 65.71,82.23 65.71,85.09 SV3.4
INT-LD  (via drill 0.33)
  Top 0.152: v64.76,36.83 63.81,37.78 63.81,81.6 63.17,82.23 63.17,83.82 SV3.2
  Bottom 0.152: IC2.11 96.19,36.83 v64.76,36.83
INT-START  (via drill 0.33)
  Top 0.152: v34.91,34.61 34.28,35.24 34.28,81.28 35.23,82.23 35.23,83.82 SV1.28 37.14,85.72 v37.14,102.87
  Bottom 0.152: IC2.16 86.35,34.61 v34.91,34.61 | IC11.24 77.78,104.78 74.6,104.78 73.97,105.41 45.39,105.41 42.85,102.87 v37.14,102.87
INTA  (via drill 0.33)
  Top 0.152: IC7.19 40.31,31.75 40.31,83.82 SV1.32 v41.58,90.17 | IC13.28 63.81,92.08 v63.81,89.85
  Bottom 0.152: v63.81,89.85 63.49,90.17 v41.58,90.17
LD
  Top 0.152: IC10.19 40.63,141.29 40.63,148.91 LOADING.A
LD-INS-REG  (via drill 0.33)
  Top 0.152: IC2.13 104.76,37.78 104.76,82.23 SV3.35 | IC11.26 76.82,97.47 76.82,92.08 v79.36,89.53
  Bottom 0.152: v79.36,89.53 80.31,88.58 100.95,88.58 103.81,85.72 103.81,82.55 SV3.35
MEM-RD  (via drill 0.33)
  Top 0.152: IC7.13 50.15,33.97 50.15,12.38 51.42,11.11 85.08,11.11 85.08,79.06 87.3,81.28 SV3.21 | v82.86,106.05 82.54,105.73 82.54,86.36 83.49,85.41 v83.49,84.14
  Bottom 0.152: IC13.23 66.66,107.63 81.27,107.63 v82.86,106.05 | v83.49,84.14 83.81,83.82 86.03,83.82 SV3.21
MEM-WR  (via drill 0.33)
  Top 0.152: v82.22,33.66 83.81,35.24 83.81,81.6 SV3.19 | IC13.22 62.22,105.73 62.22,87.63 59.36,84.77 v59.36,33.66
  Bottom 0.152: IC7.12 52.69,33.97 59.36,33.97 | 59.36,33.97 81.9,33.97 v82.22,33.66 | 59.36,33.97 v59.36,33.66
N$1
  Top 0.152: R1.1 104.13,143.19 104.13,148.91 PWR1.A
N$6  (via drill 0.33)
  Top 0.152: v29.52,125.09 IC10.9 | C11.2 41.58,125.73 Q1.2
  Bottom 0.152: v29.52,125.09 29.83,125.41 41.58,125.41 Q1.2
N$7
  Bottom 0.152: IC10.10 27.93,120.97 41.58,120.97 Q1.1 41.58,120.65 C12.2
N$8
  Top 0.152: C13.1 DTR-RESET.2
N$17
  Top 0.152: IC10.21 22.21,126.05 22.21,115.25 C14.2
N$25
  Top 0.152: READY.K R11.1
N$26
  Top 0.152: LOADING.K R16.1
N$27
  Top 0.152: FAULT.K R6.1
N$30
  Bottom 0.152: IC10.23 16.18,137.79 14.28,137.79 UCODE.2
N$32
  Bottom 0.152: IC9.7 11.1,96.52 JP4.2
N$33
  Top 0.152: DTR-RESET.1 74.6,142.24 JP3.P$1
N$34
  Top 0.152: FTDI-VCC.2 82.22,144.78 JP3.P$4
N$39
  Bottom 0.152: R25.1 32.69,104.14 10.46,104.14 2.53,112.08 2.53,128.59 7.61,128.59 | 7.61,128.59 9.51,128.59 IC10.25 | 7.61,128.59 7.61,141.92 8.24,142.56 18.72,142.56 26.02,149.86 START.1
OPERAND-CLK
  Top 0.152: IC1.12 100.95,73.98 100.95,80.96 SV3.33
OUT-OFF  (via drill 0.33)
  Top 0.152: v75.55,26.99 73.65,28.89 73.65,81.92 73.33,82.23 73.33,83.82 SV3.10 71.74,85.41 71.74,107.63 74.28,107.63 IC11.21
  Bottom 0.152: IC2.19 86.35,26.99 v75.55,26.99
OUT-ON  (via drill 0.33)
  Top 0.152: v71.42,69.85 70.79,70.48 70.79,83.82 SV3.8 69.52,115.25 74.28,115.25 74.92,114.62 74.92,113.35 91.43,113.35 92.7,112.08 92.7,111.76 IC12.8
  Bottom 0.152: v71.42,69.85 IC3.11
READY  (via drill 0.33)
  Top 0.152: IC10.18 30.47,125.41 32.37,125.41 32.37,130.49 33.96,132.08 | READY.A 33.96,132.08 | v46.02,73.66 45.39,74.3 45.39,83.82 SV1.36 46.66,117.16 40.63,123.19 40.63,125.41 33.96,132.08
  Bottom 0.152: ROM.10 106.98,74.3 103.81,74.3 103.17,73.66 v46.02,73.66
REG-BRD-LD-ID0  (via drill 0.33)
  Top 0.152: IC8.12 28.25,34.92 28.25,80.33 28.88,80.96 SV1.21 | IC14.2 57.14,96.52 57.14,88.9 v57.45,88.58
  Bottom 0.152: v57.45,88.58 57.14,88.27 52.06,88.27 51.74,87.95 30.15,87.95 27.61,85.41 27.61,82.55 SV1.21
REG-BRD-LD-ID1  (via drill 0.33)
  Top 0.152: IC8.13 27.93,37.15 v27.93,80.96 27.61,81.28 27.61,93.03 v31.74,97.16
  Bottom 0.152: v27.93,80.96 28.25,81.28 30.15,81.28 SV1.23 | IC14.3 59.36,100.33 34.91,100.33 v31.74,97.16
REG-BRD-RD-ID0  (via drill 0.33)
  Top 0.152: 17.45,78.74 18.72,80.01 SV1.13 | 17.45,78.74 IC5.17 | v19.04,94.3 18.4,93.66 18.4,86.36 17.45,85.41 17.45,78.74
  Bottom 0.152: IC14.26 49.84,95.89 20.62,95.89 v19.04,94.3
REG-BRD-RD-ID1
  Top 0.152: IC5.18 20.94,69.85 20.94,72.71 21.26,73.03 SV1.15
  Bottom 0.152: IC14.27 52.06,95.57 24.75,95.57 19.99,90.81 10.15,90.81 4.75,85.41 4.75,69.85 IC5.18
REG-FUNC  (via drill 0.33)
  Top 0.152: v10.78,104.78 4.75,98.74 4.75,83.82 SV1.3
  Bottom 0.152: IC5.11 25.71,70.48 17.45,70.48 11.42,76.52 10.15,76.52 6.02,80.64 SV1.3 | IC14.21 52.69,111.44 17.45,111.44 v10.78,104.78
REG-LD-HI  (via drill 0.33)
  Top 0.152: v49.2,32.7 46.66,35.24 SV1.35 46.66,83.19 47.93,84.45 47.93,110.17 60.95,110.17 62.22,111.44 62.22,111.76 IC13.21
  Bottom 0.152: IC7.11 49.52,32.7 v49.2,32.7
REG-LD-ID0  (via drill 0.33)
  Top 0.152: v28.88,40.32 33.96,45.4 SV1.25 33.96,83.19 35.23,84.45 35.23,85.41 34.59,86.04 34.59,100.01 v35.87,101.28
  Bottom 0.152: IC8.15 13.32,40.32 v28.88,40.32 | IC14.4 59.68,102.55 45.39,102.55 44.12,101.28 v35.87,101.28
REG-LD-ID1  (via drill 0.33)
  Top 0.152: v34.91,39.69 34.91,65.09 36.18,66.36 38.09,66.36 38.09,80.96 SV1.27 | IC14.5 56.82,100.33 v56.82,80.33
  Bottom 0.152: IC8.16 15.23,39.69 v34.91,39.69 | v56.82,80.33 38.72,80.33 SV1.27
REG-LD-LO  (via drill 0.33)
  Top 0.152: v40.95,32.07 41.58,32.7 SV1.31 | IC14.7 54.91,103.5 54.91,92.39 54.6,92.08 v54.6,81.28
  Bottom 0.152: IC8.18 12.69,32.07 v40.95,32.07 | v54.6,81.28 54.28,80.96 43.17,80.96 SV1.31
REG-RD-HI  (via drill 0.33)
  Top 0.152: v44.44,68.9 44.12,69.22 SV1.33 44.12,83.19 45.39,84.45 45.39,85.41 45.71,85.72 45.71,110.49 v46.02,110.81
  Bottom 0.152: IC8.19 9.51,29.53 9.51,68.9 v44.44,68.9 | IC14.8 59.68,110.81 v46.02,110.81
REG-RD-ID0  (via drill 0.33)
  Top 0.152: IC5.19 23.8,67.31 SV1.17 | IC14.28 52.38,93.34 v52.38,89.22
  Bottom 0.152: v52.38,89.22 51.42,88.27 25.39,88.27 22.53,85.41 22.53,82.55 SV1.17
REG-RD-ID1  (via drill 0.33)
  Top 0.152: IC8.11 24.75,32.07 24.75,80.96 SV1.19 26.34,83.5 25.07,84.77 25.07,90.49 v25.71,91.12
  Bottom 0.152: IC14.1 60,94.61 54.28,94.61 53.96,94.93 44.76,94.93 40.95,91.12 v25.71,91.12
REG-RD-LO  (via drill 0.33)
  Top 0.152: v38.72,36.51 39.68,37.47 39.68,81.92 SV1.29 | IC14.6 56.5,102.55 56.5,81.92 v55.87,81.28
  Bottom 0.152: IC8.17 14.59,36.51 v38.72,36.51 | v55.87,81.28 55.23,80.64 40.95,80.64 SV1.29
SCL
  Top 0.152: R5.1 2.53,110.17 2.53,126.05 IC10.28
  Bottom 0.152: IC9.6 12.37,95.25 6.34,95.25 2.53,99.06 2.53,109.22 R5.1 | 72.38,120.97 61.58,120.97 IC14.12 59.68,122.87 7.61,122.87 IC10.28 | IC13.12 72.38,120.97 | 85.08,120.97 IC11.12 | 72.38,120.97 85.08,120.97 | 97.78,120.97 IC12.12 | 85.08,120.97 97.78,120.97 | IC1-5.12 110.48,120.97 97.78,120.97
SDA
  Top 0.152: IC10.27 4.43,125.41 4.43,106.36 R12.1 | IC14.13 64.12,124.46 64.12,124.78 64.76,125.41 73.33,125.41 IC13.13
  Bottom 0.152: IC9.5 18.4,101.92 6.97,101.92 R12.1 | 85.08,125.41 IC11.13 | 85.08,125.41 74.28,125.41 IC13.13 | 97.78,125.41 IC12.13 | 85.08,125.41 97.78,125.41 | IC1-5.13 110.48,125.41 97.78,125.41 | IC10.27 9.51,123.51 59.68,123.51 IC14.13
SOFT-RESET  (via drill 0.33)
  Top 0.152: v83.49,31.43 80.95,33.97 v80.95,80.96 | IC11.22 74.92,105.73 74.92,97.47 75.23,97.16 75.23,85.72 SV3.12
  Bottom 0.152: IC2.18 86.35,31.43 v83.49,31.43 | v80.95,80.96 80.63,81.28 74.28,81.28 73.33,82.23 73.33,85.09 SV3.12
SP/PC-ADDR-RD  (via drill 0.33)
  Top 0.152: IC6.19 34.91,68.9 v34.91,79.06 | v32.05,112.71 23.8,104.46 SV1.18
  Bottom 0.152: v34.91,79.06 33.64,80.33 26.98,80.33 25.07,82.23 25.07,83.19 24.75,83.19 23.8,84.14 SV1.18 | IC13.8 72.38,112.71 v32.05,112.71
SP/PC-DATA-RD-HI  (via drill 0.33)
  Top 0.152: v21.9,71.12 22.21,71.44 22.21,81.92 22.53,82.23 22.53,83.82 SV1.16 21.26,102.87 v26.34,107.95
  Bottom 0.152: IC6.18 35.23,71.12 v21.9,71.12 | IC13.7 72.06,107.95 v26.34,107.95
SP/PC-DATA-RD-LO  (via drill 0.33)
  Top 0.152: v20.62,73.34 19.99,73.98 19.99,83.82 SV1.14 20.94,87.31 20.94,103.5 v24.44,107
  Bottom 0.152: IC6.17 35.55,73.34 v20.62,73.34 | IC13.6 72.38,105.73 45.07,105.73 43.8,107 v24.44,107
SP/PC-DN  (via drill 0.33)
  Top 0.152: IC4.17 60,31.11 55.87,31.11 v55.87,79.06 | IC12.23 94.6,103.19 94.6,89.22 v93.33,87.95
  Bottom 0.152: v55.87,79.06 54.91,80.01 34.91,80.01 32.69,82.23 32.69,85.09 32.37,85.09 | SV1.24 32.37,85.09 | v93.33,87.95 92.7,87.31 55.87,87.31 55.23,86.68 33.96,86.68 32.37,85.09
SP/PC-LD-HI  (via drill 0.33)
  Top 0.152: IC4.18 55.23,30.48 v55.23,87.63 | IC12.22 87.62,105.73 87.62,90.49 v85.08,87.95
  Bottom 0.152: SV1.22 31.1,87.31 54.91,87.31 v55.23,87.63 84.76,87.63 v85.08,87.95
SP/PC-LD-LO  (via drill 0.33)
  Top 0.152: v24.75,26.99 24.44,27.3 24.44,81.6 25.07,82.23 v25.07,83.82 | v32.05,110.17 26.34,104.46 SV1.20
  Bottom 0.152: IC4.19 60.95,26.99 v24.75,26.99 | SV1.20 v25.07,83.82 | IC12.21 90.16,110.81 60.31,110.81 59.68,110.17 v32.05,110.17
SP/PC-SEL  (via drill 0.33)
  Top 0.152: SV1.12 v16.18,102.87
  Bottom 0.152: IC6.16 35.55,73.98 18.09,73.98 9.83,82.23 9.83,86.36 14.91,86.36 SV1.12 | IC13.5 72.38,105.09 45.71,105.09 42.85,102.23 19.36,102.23 18.72,102.87 v16.18,102.87
SP/PC-UP  (via drill 0.33)
  Top 0.152: IC4.16 60,37.47 v60,81.6 | v77.78,105.41 76.5,104.14 v76.5,86.68
  Bottom 0.152: 55.23,86.36 v60,81.6 | 55.23,86.36 35.23,86.36 SV1.26 | IC12.24 89.84,105.41 v77.78,105.41 | v76.5,86.68 76.19,86.36 55.23,86.36
SR-LD  (via drill 0.33)
  Top 0.152: v81.59,76.52 82.22,77.15 SV3.17 82.22,83.19 80.95,84.45 80.95,85.41 81.9,86.36 81.9,110.17 92.7,110.17 IC12.5
  Bottom 0.152: IC3.15 62.85,76.52 v81.59,76.52
TEST-IN  (via drill 0.33)
  Top 0.152: v70.47,32.07 66.03,36.51 v66.03,78.11
  Bottom 0.152: IC2.17 86.35,32.07 v70.47,32.07 | v66.03,78.11 63.17,80.96 57.14,80.96 56.19,81.92 52.69,81.92 52.06,81.28 43.8,81.28 42.85,82.23 42.85,85.09 SV1.34
UCODE-COUNT-RESET
  Top 0.152: IC2.12 105.08,35.56 105.08,80.01 SV3.37
  Bottom 0.152: IC11.27 79.36,95.57 88.25,95.57 88.57,95.25 99.68,95.25 100,94.93 112.38,94.93 113.02,94.3 113.02,83.82 108.89,83.82 SV3.37
VCC
  Top 0.152: R3.2 8.88,22.54 8.88,7.3 IC8.28 | C20.2 C18.2 | SV1.2 SV1.1 3.48,66.36 11.42,66.36 13.01,64.77 13.01,46.35 C23.2 | IC10.7 14.59,115.25 14.59,110.17 R5.2 R12.2 13.64,101.6 IC9.8 IC9.1 | IC10.20 22.53,125.73 22.53,107.95 C15.2 | ROM.5 ROM.7 ROM.9 110.16,80.96 111.43,82.23 111.43,88.9 C2.2 | 91.11,125.41 IC12.15 91.11,132.08 | 91.11,125.41 IC12.16 | 91.11,132.08 R1.2 | FTDI-VCC.1 91.11,133.35 91.11,132.08 | IC14.9 64.12,117.79 64.12,122.87 IC13.16 | IC11.9 80,120.33 | 80,120.33 IC11.17 | 91.11,125.41 80,125.41 80,120.33 | C5.2 71.42,92.08 71.42,112.39 IC13.9
  Bottom 0.152: IC5.28 13.64,41.91 C23.2 17.77,42.23 | 35.55,45.4 IC6.28 | 35.55,45.4 20.94,45.4 17.77,42.23 | 60.95,45.4 IC3.28 | 35.55,45.4 60.95,45.4 | IC1.28 86.35,45.4 60.95,45.4 | 41.9,40.96 C18.2 | 41.9,40.96 19.04,40.96 17.77,42.23 | 67.3,40.96 C19.2 | 41.9,40.96 67.3,40.96 | C17.2 93.02,41.27 71.74,41.27 71.42,40.96 67.3,40.96 | IC8.28 13.64,2.54 C21.2 19.04,4.13 37.45,4.13 | C16.2 89.84,2.54 IC2.28 85.71,3.49 69.2,3.49 C22.2 64.44,2.54 62.85,4.13 | 37.45,4.13 39.04,2.54 C20.2 44.44,4.13 62.85,4.13 | 37.45,4.13 IC7.28 | 62.85,4.13 IC4.28 | IC9.3 IC9.2 IC9.1 11.1,92.71 SV1.2 | R8.1 7.29,109.22 R5.2 | JP4.3 8.56,100.33 IC9.8 | R25.2 43.17,106.36 20.94,106.36 | C15.2 20.94,106.36 | UCODE.1 8.56,128.91 13.64,128.91 15.23,127.32 15.23,125.41 22.21,125.41 IC10.20 25.39,128.59 46.02,128.59 47.61,127 IC14.15 54.6,125.41 64.76,125.41 IC13.16 | R12.2 14.59,106.36 20.94,106.36 | C6.2 59.04,92.39 69.84,92.39 C5.2 71.42,92.08 80,92.08 80.31,92.39 84.44,92.39 | 84.44,92.39 C4.2 | 84.44,92.39 95.24,92.39 C3.2 102.54,91.44 103.49,92.39 107.94,92.39 C2.2 | IC14.9 61.58,115.25 72.38,115.25 IC13.9 74.28,115.25 86.98,115.25 | 97.78,115.25 IC12.9 | 86.98,115.25 97.78,115.25 | IC11.9 86.98,115.25 | IC1-5.9 110.48,115.25 97.78,115.25
VPGM
  Top 0.152: IC7.1 49.84,6.99 49.84,42.55 IC6.1
  Bottom 0.152: IC8.1 27.29,6.03 50.79,6.03 | IC7.1 50.79,6.03 | 76.19,6.03 IC4.1 | 50.79,6.03 76.19,6.03 | IC2.1 101.59,6.03 76.19,6.03 | IC5.1 27.29,43.5 50.79,43.5 | IC6.1 50.79,43.5 | 76.19,43.5 IC3.1 | 50.79,43.5 76.19,43.5 | 76.19,43.5 101.59,43.5 IC1.1 109.21,44.45 109.21,70.8 ROM.8

## Text on the board
tNames: DOWN / LOAD | WRITE / MEM | WP | YACC1 SEQUENCER MEMORY BOARD V1.0 | www.onepagecomputer.com